# EAGLE design Teensy_ETH (EAGLE 9.6.2)

## Sheet 1 of 2
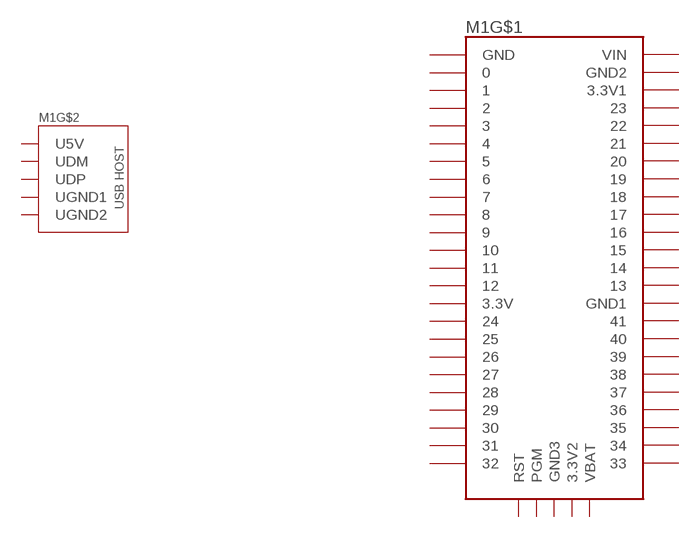
[diagram p0: schematic, sheet 1]

### Parts
M1  TEENSY4.1  [TEENSY4.1]
Unconnected: M1.0/RX M1.1/TX M1.2 M1.3 M1.3V3(3.3V) M1.3V3_LO(3.3V1) M1.4 M1.5 M1.6 M1.7 M1.8 M1.9 M1.10/CS M1.11/MOSI M1.12/MISO M1.13/SCK M1.14/A0 M1.15/A1 M1.16/A2 M1.17/A3 M1.18/A4/SDA M1.19/A5/SCL M1.20/A6 M1.21/A7 M1.22/A8 M1.23/A9 M1.24 M1.25 M1.26 M1.27 M1.28 M1.29 M1.30 M1.31/A12 M1.32 M1.33 M1.34 M1.35 M1.36 M1.37 M1.38 M1.39 M1.40 M1.41 M1.AGND(GND2) M1.GND M1.GND1 M1.GND2(GND3) M1.GND-U1(UGND1) M1.GND-U2(UGND2) M1.PROG(PGM) M1.RST M1.UD+(UDP) M1.UD-(UDM) M1.UVHST(U5V) M1.V33(3.3V2) M1.VBAT M1.VIN

## Sheet 2 of 2
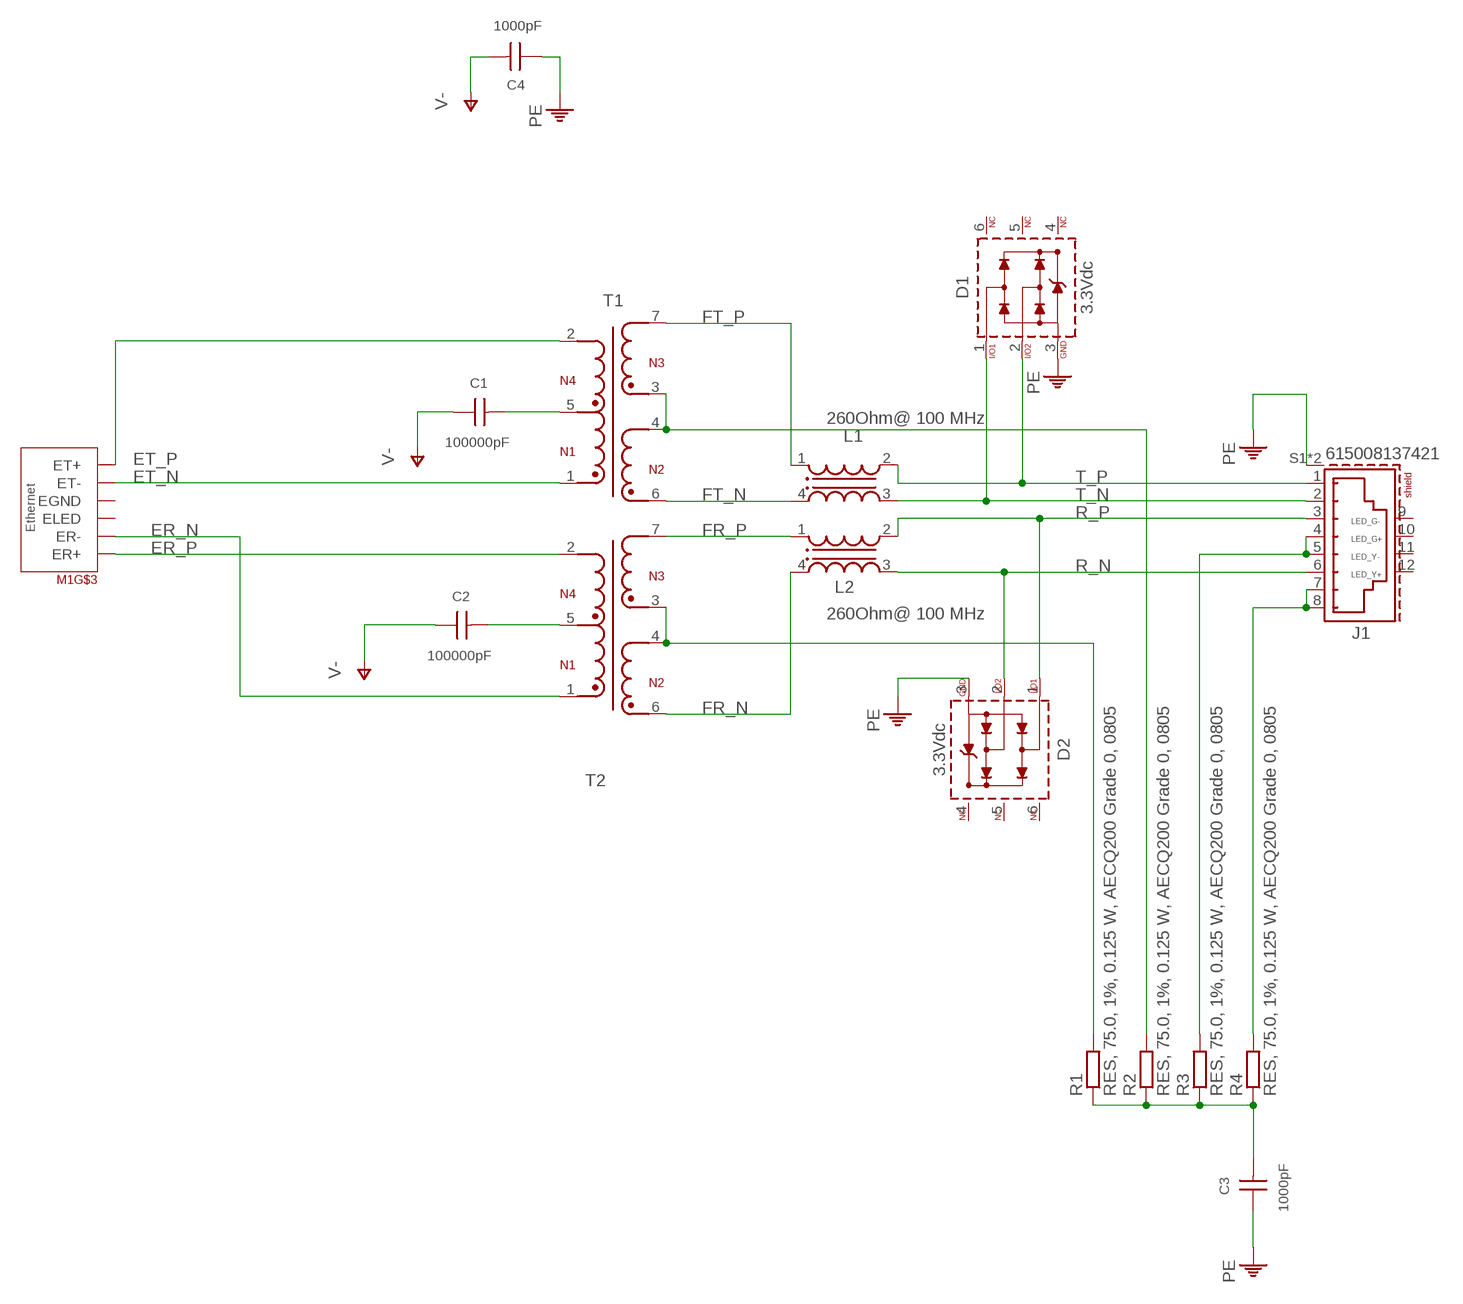
[diagram p1: schematic, sheet 2]

### Parts
C1  100000pF  WCAP-CSST_0603_885382206004_R  [WCAP-CSST_0603_R]
C2  100000pF  WCAP-CSST_0603_885382206004_R  [WCAP-CSST_0603_R]
C3  1000pF  WCAP-CSMH_1206_H1.6_885342208024  [WCAP-CSMH_1206_H1.6_R]
C4  1000pF  WCAP-CSMH_1206_H1.6_885342208024  [WCAP-CSMH_1206_H1.6_R]
D1  3.3Vdc  WE-TVS-SS_DFN1210-6L_824012823  [WE-TVS_DFN1210-6L]
D2  3.3Vdc  WE-TVS-SS_DFN1210-6L_824012823  [WE-TVS_DFN1210-6L]
J1  615008137421  [615008137421]
L1  260Ohm@ 100 MHz  WE-CNSW_0805_744231261  [WE-CNSW_0805]
L2  260Ohm@ 100 MHz  WE-CNSW_0805_744231261  [WE-CNSW_0805]
R1  RES, 75.0, 1%, 0.125 W, AECQ200 Grade 0, 0805  R-EU_R0805  [R0805]
R2  RES, 75.0, 1%, 0.125 W, AECQ200 Grade 0, 0805  R-EU_R0805  [R0805]
R3  RES, 75.0, 1%, 0.125 W, AECQ200 Grade 0, 0805  R-EU_R0805  [R0805]
R4  RES, 75.0, 1%, 0.125 W, AECQ200 Grade 0, 0805  R-EU_R0805  [R0805]
T1  WE-STST_4532_74930000  [WE-STST_74930000]
T2  WE-STST_4532_74930000  [WE-STST_74930000]

### Nets
ER_N: M1.ER- T2.1
ER_P: M1.ER+ T2.2
ET_N: M1.ET+(ET-) T1.1
ET_P: M1.ET-(ET+) T1.2
FR_N: L2.4 T2.6
FR_P: L2.1 T2.7
FT_N: L1.4 T1.6
FT_P: L1.1 T1.7
N$1: R2.2 T1.3 T1.4
N$2: R1.2 T2.3 T2.4
N$7: J1.4 J1.5 R3.2
N$8: J1.7 J1.8 R4.2
N$17: C1.2 T1.5
N$18: C2.2 T2.5
N$19: C3.2 R1.1 R2.1 R3.1 R4.1
PE: C3.1 C4.1 D1.3(GND) D2.3(GND) J1.S1(SHIELD) J1.S2(SHIELD)
R_N: D2.2(I/O2) J1.6 L2.3
R_P: D2.1(I/O1) J1.3 L2.2
T_N: D1.1(I/O1) J1.2 L1.3
T_P: D1.2(I/O2) J1.1 L1.2
V-: C1.1 C2.1 C4.2
Unconnected: D1.4(NC) D1.5(NC1) D1.6(NC2) D2.4(NC) D2.5(NC1) D2.6(NC2) J1.9(G-) J1.10(G+) J1.11(Y-) J1.12(Y+) M1.ELED M1.GND-E(EGND)

## Library data of the parts
C1 C2 = Wurth_Capacitors_WCAP-CSST:WCAP-CSST_0603: WCAP-CSST MLCCs Soft Termination Characteristics Product series with high absorbtion of mechanical stress Mounting style: SMT-Chip Capacitance range: 220 pF - 2.2 µF Temperature Coefficient: ± 15 % Voltage range (UR): 16 V(DC) - 2 kV(DC) Operating temperature: -55 °C up to + 125 °C Sizes: 0603 / 0805 / 1206 / 1210 Termination: Ag-Polymer/Ni/Sn Recommended soldering: Reflow soldering Wave soldering (only valid for the thickness ≤0.85 mm) Applications Application with high mechanical stress Power supply Lighting <https://www.we-online.com/catalog/media/o164343v209%20Family_WE-MLCC_1210_dunkelbraun.jpg> Details see: https://www.we-online.com/catalog/en/WCAP-CSST/ Updated by yingchun,Shan;2020-03-10 2020(C) Würth Elektronik; CERAMIC-TYPE: X7R Class II; DATASHEET-URL: https://www.we-online.com/catalog/datasheet/885382206004.pdf; DF: 3.0%; H: 0.8mm; OPERATING-TEMPERATURE: -55 / +125°C; PART-NUMBER: 885382206004; RISO: 5GOhm; TECHNICAL-REFERENCE: X7R0603104K050DFCT1S000; TOL-C: +/- 10%; VR: 50V(DC)
C3 C4 = Wurth_Capacitors_WCAP-CSMH:WCAP-CSMH_1206_H1.6: WCAP-CSMH MLCCs Mid and High Voltage Characteristics Product series for mid and high voltage up to 3 kV(DC) Mounting style: SMT-Chip Ceramic: NP0 (Class I), X7R (Class II) Capacitance range: 10 pF ‒ 470 nF Temperature Coefficient: ±30 ppm/°C; ±0.54 % for NP0 ±15 % for X7R Voltage range (UR): 200 V(DC) ‒ 3 kV(DC) Operating temperature: -55 °C up to + 125 °C Sizes: 0603 / 0805 / 1206 / 1210 / 1808 / 1812 Termination: Cu/Ni/Sn Recommended soldering: Reflow soldering Wave soldering only valid for 0603, 0805; thickness < 0.85 mm Applications Ports protection against EFT and surge Blocking High voltage coupling Snubber <https://www.we-online.com/catalog/media/o166505v209%20Family_WE-MLCC_1210.jpg> Details see: www.we-online.com/catalog/WCAP-CSMH <www.we-online.com/catalog/WCAP-CSMH/?utm_source=eagle_model&utm_medium=description_link&utm_campaign=eisos_eagle> Updated by Ella Wu 2022-08-02 2022(C) Würth Elektronik; CERAMIC-TYPE: X7R Class II; DATASHEET-URL: https://www.we-online.com/redexpert/spec/885342208024?ae; DF: 2.5%; H: 1.6mm; OPERATING-TEMPERATURE: -55 °C up to + 125 °C; PART-NUMBER: 885342208024; QMIN: -; RISO: 10GOhm; SIZE: 1206; TECHNICAL-REFERENCE: X7R1206102KB00DFCT10000; VR: 2000V(DC)
D1 D2 = Wurth_EMC Components_WE-TVS:WE-TVS-SS_DFN1210-6L_824012823: WE-TVS TVS Diode – Super Speed Series Characteristics Fast turn-on Low clamping voltage Very low capacitance Rail to Rail protection Small package Epoxy flame resistant UL94-V0 Applications Super Speed data lines HDMI 1.3/1.4/2.0, DVI DisplayPort USB 3.1 Gen 1 (5Gb/s) SATA and eSATA GBit LAN Thunderbolt LVDS ESD protection in accordance with EN 61000-4-2 – 8 kV contact discharge – 15 kV air discharge SS = Super Speed <https://www.we-online.com/catalog/media/o106434v209%20Family_WE-TVS-SuperSpeed.jpg> Details see: https://www.we-online.com/catalog/en/WE-TVS-SS Updated by Ella Wu 2019-07-12 2019 (C) Wurth Elektronik; C-CH: 0.18pF; CHANNELS: 2; DATASHEET-URL: https://www.we-online.com/catalog/datasheet/824012823.pdf; IPEAK: 3A; MOUNT: SMT; PART-NUMBER: 824012823; VBR: 4.5V
J1 = Wurth_Connectors_WR-MJ:615008137421: WR-MJ Modular Jack Tab Up General Information Operating Temperature -40 up to +85 °C LED 2xBipolar Y/G; yellow-green Electrical Properties Working Voltage 120 V (AC) Withstanding Voltage 1000 V (AC) Contact Resistance 20 mΩ RISO 500 MΩ Material Properties Insulator Material PBT Insulator Flammability Rating UL94 V-0 Insulator Color Black Contact Material Copper Alloy Contact Plating Selective Gold Contact Type Stamped Shielding Material Bronze Shielding Plating Nickel (Ni) Packaging Properties Packaging Tray <https://www.we-online.com/components/media/o33152v209%20Family_WR-MJ_6150081xxx21.jpg> Details see: www.we-online.com/en/components/products/MJ_HORIZONTAL_SHIELDED_W_LED_AND_EMI_PANEL_FINGER_8P8C_TAB_UP <www.we-online.com/catalog/MJ_HORIZONTAL_SHIELDED_W_LED_AND_EMI_PANEL_FINGER_8P8C_TAB_UP/?utm_source=eagle_model&utm_medium=description_link&utm_campaign=eisos_eagle> Updated by Ella Wu 2023-11-13 2023 (C) Würth Elektronik; DATASHEET-URL: https://www.we-online.com/redexpert/spec/615008137421?ae; LED: yellow-green; MOUNT: THT; PART-NUMBER: 615008137421; TYPE: Horizontal; XPXC: 8P8C
L1 L2 = Wurth_EMC Components_WE-CNSW:WE-CNSW_0805: WE-CNSW SMD Common Mode Line Filter Characteristics Current compensated data line filter High common mode noise suppression at high frequencies Small influence on high speed signals through winding symmetry Climatic category 40/105/21 (Size 0603) Climatic category 40/125/21 (Size 0805/1206/1812) Flammability corresponding to UL 94 V-0 Applications USB 2.0 IEEE 1394 (Firewire) LVDS High Speed Data Lines LAN <https://katalog.we-online.com/media/images/v2/o14771v209%20we-cnsw_stroko_smd_gruppe.jpg> Details see: http://katalog.we-online.de/en/pbs/WE-CNSW Updated by Ella Wu 2019-01-09 2019 (C) Wurth Elektronik; DATASHEET-URL: https://katalog.we-online.com/pbs/datasheet/744231261.pdf; IR: 300mA; MOUNT: SMT; PART-NUMBER: 744231261; RDC: 0.4Ohm; VR: 50V; VT: 125 V (AC)
M1 = teensy4.1.dist:TEENSY4.1
R1-R4 = resistor:R-EU_: RESISTOR, European symbol
T1 T2 = Wurth_Signal & Communications_WE-STST:WE-STST_4532: WE-STST Super Tiny Signal Transformer Characteristics Super small size 1.5 kV isolation voltage 350 µH OCL as per IEEE 802.3 Operating temperature: -40 °C up to +105 °C Applications Ethernet 10/100/1000 Base-T Ethernet 2.5/5G and 10G Base-T Single Pair Ethernet Ultrasonic sensors g.fast <https://www.we-online.com/components/media/o156816v209%20Family_WE-STST.jpg> Details see: www.we-online.com/en/components/products/WE-STST <www.we-online.com/catalog/WE-STST/?utm_source=eagle_model&utm_medium=description_link&utm_campaign=eisos_eagle> Updated by Ella Wu 2023-12-25 2023(C) Wurth Elektronik; DATA-RATE: 10/100/1000 Base-T, 10/100 Base-T1; DATASHEET-URL: https://www.we-online.com/catalog/datasheet/74930000.pdf; L: 350uH; MOUNT: SMT; PART-NUMBER: 74930000; TURNS-RATIO: 1:1; VT: 1500 V (RMS)

## Board
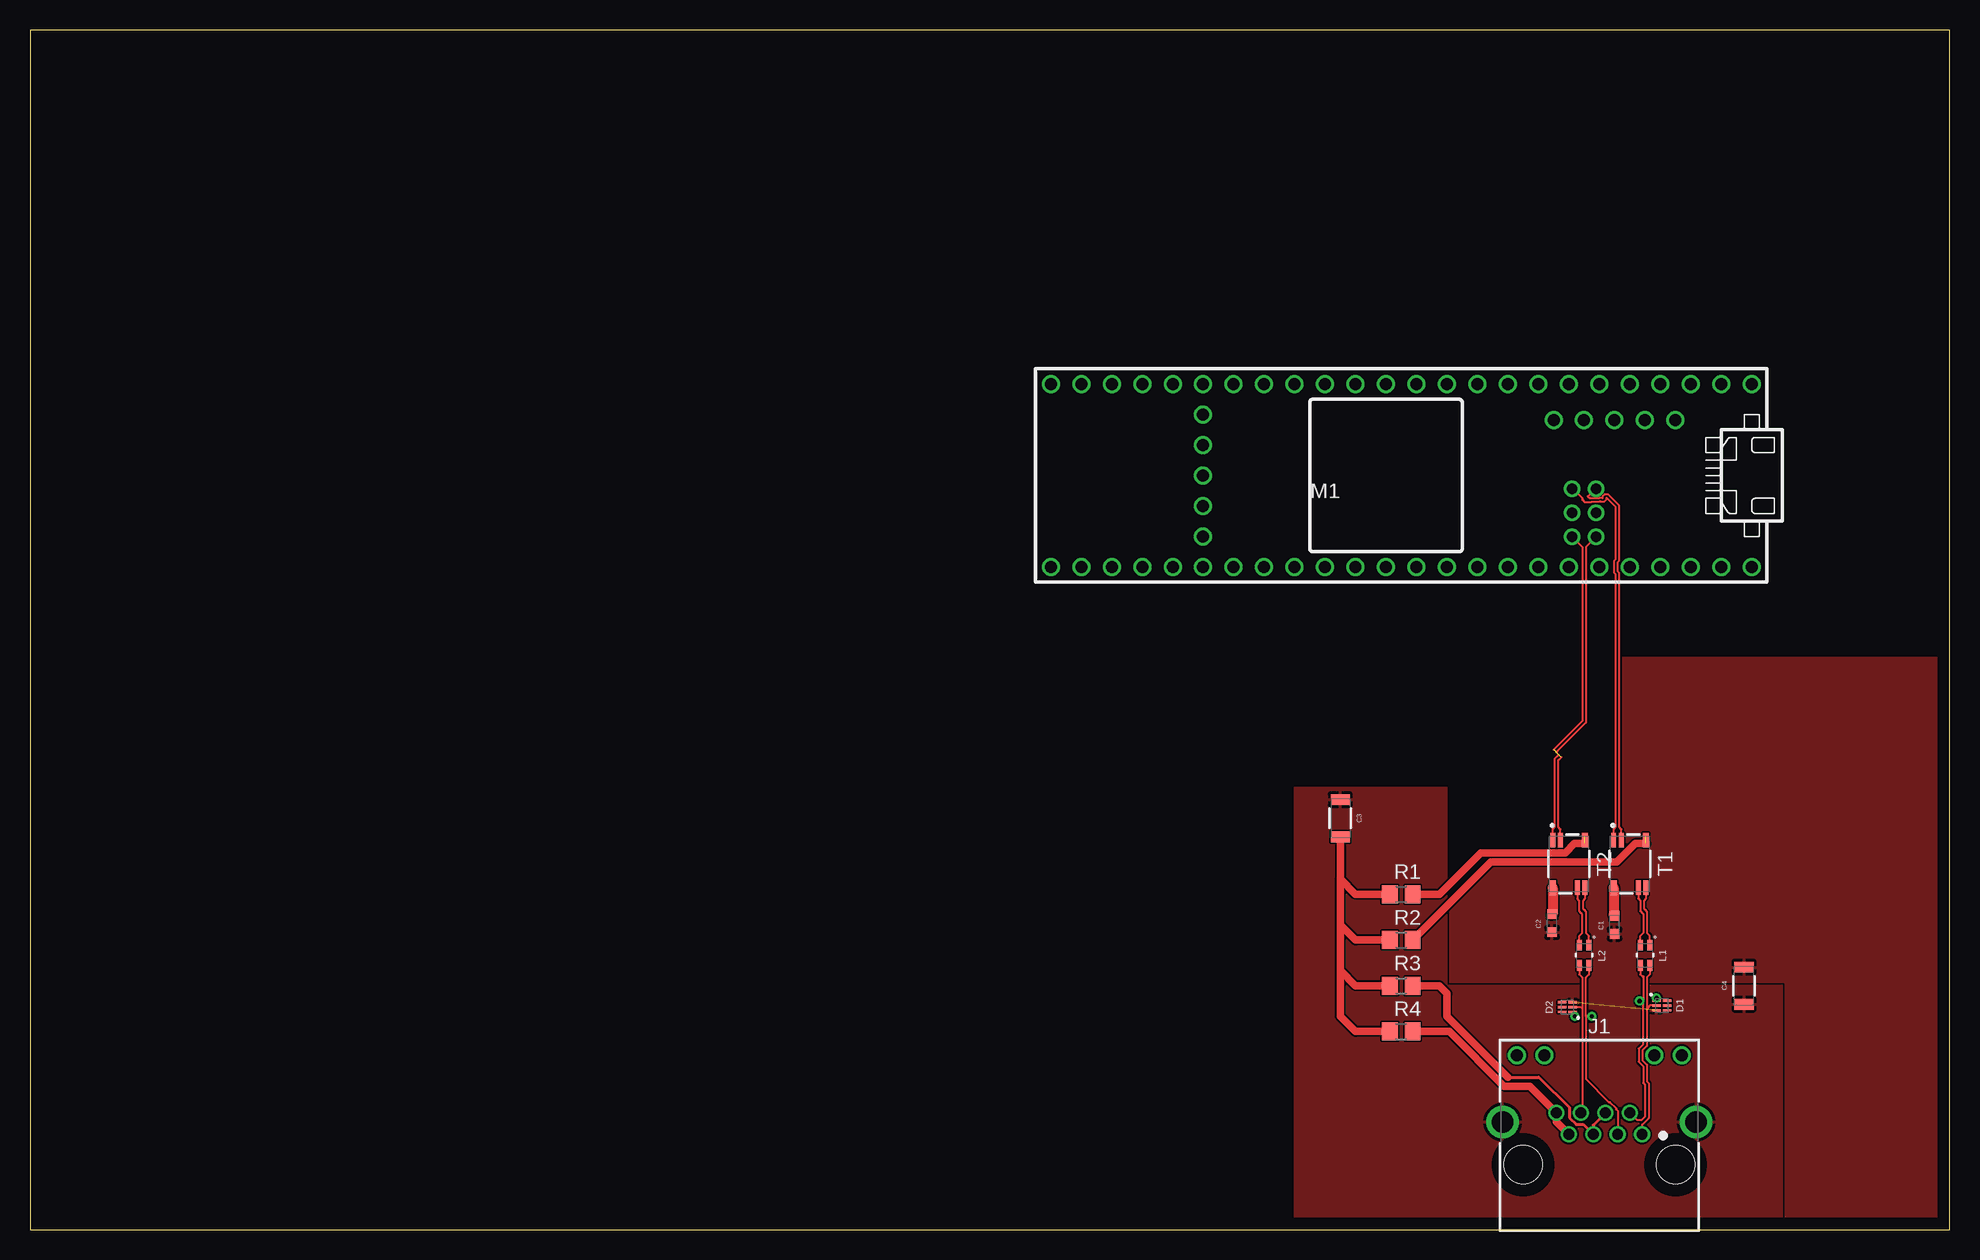
[diagram p2: board, top side]
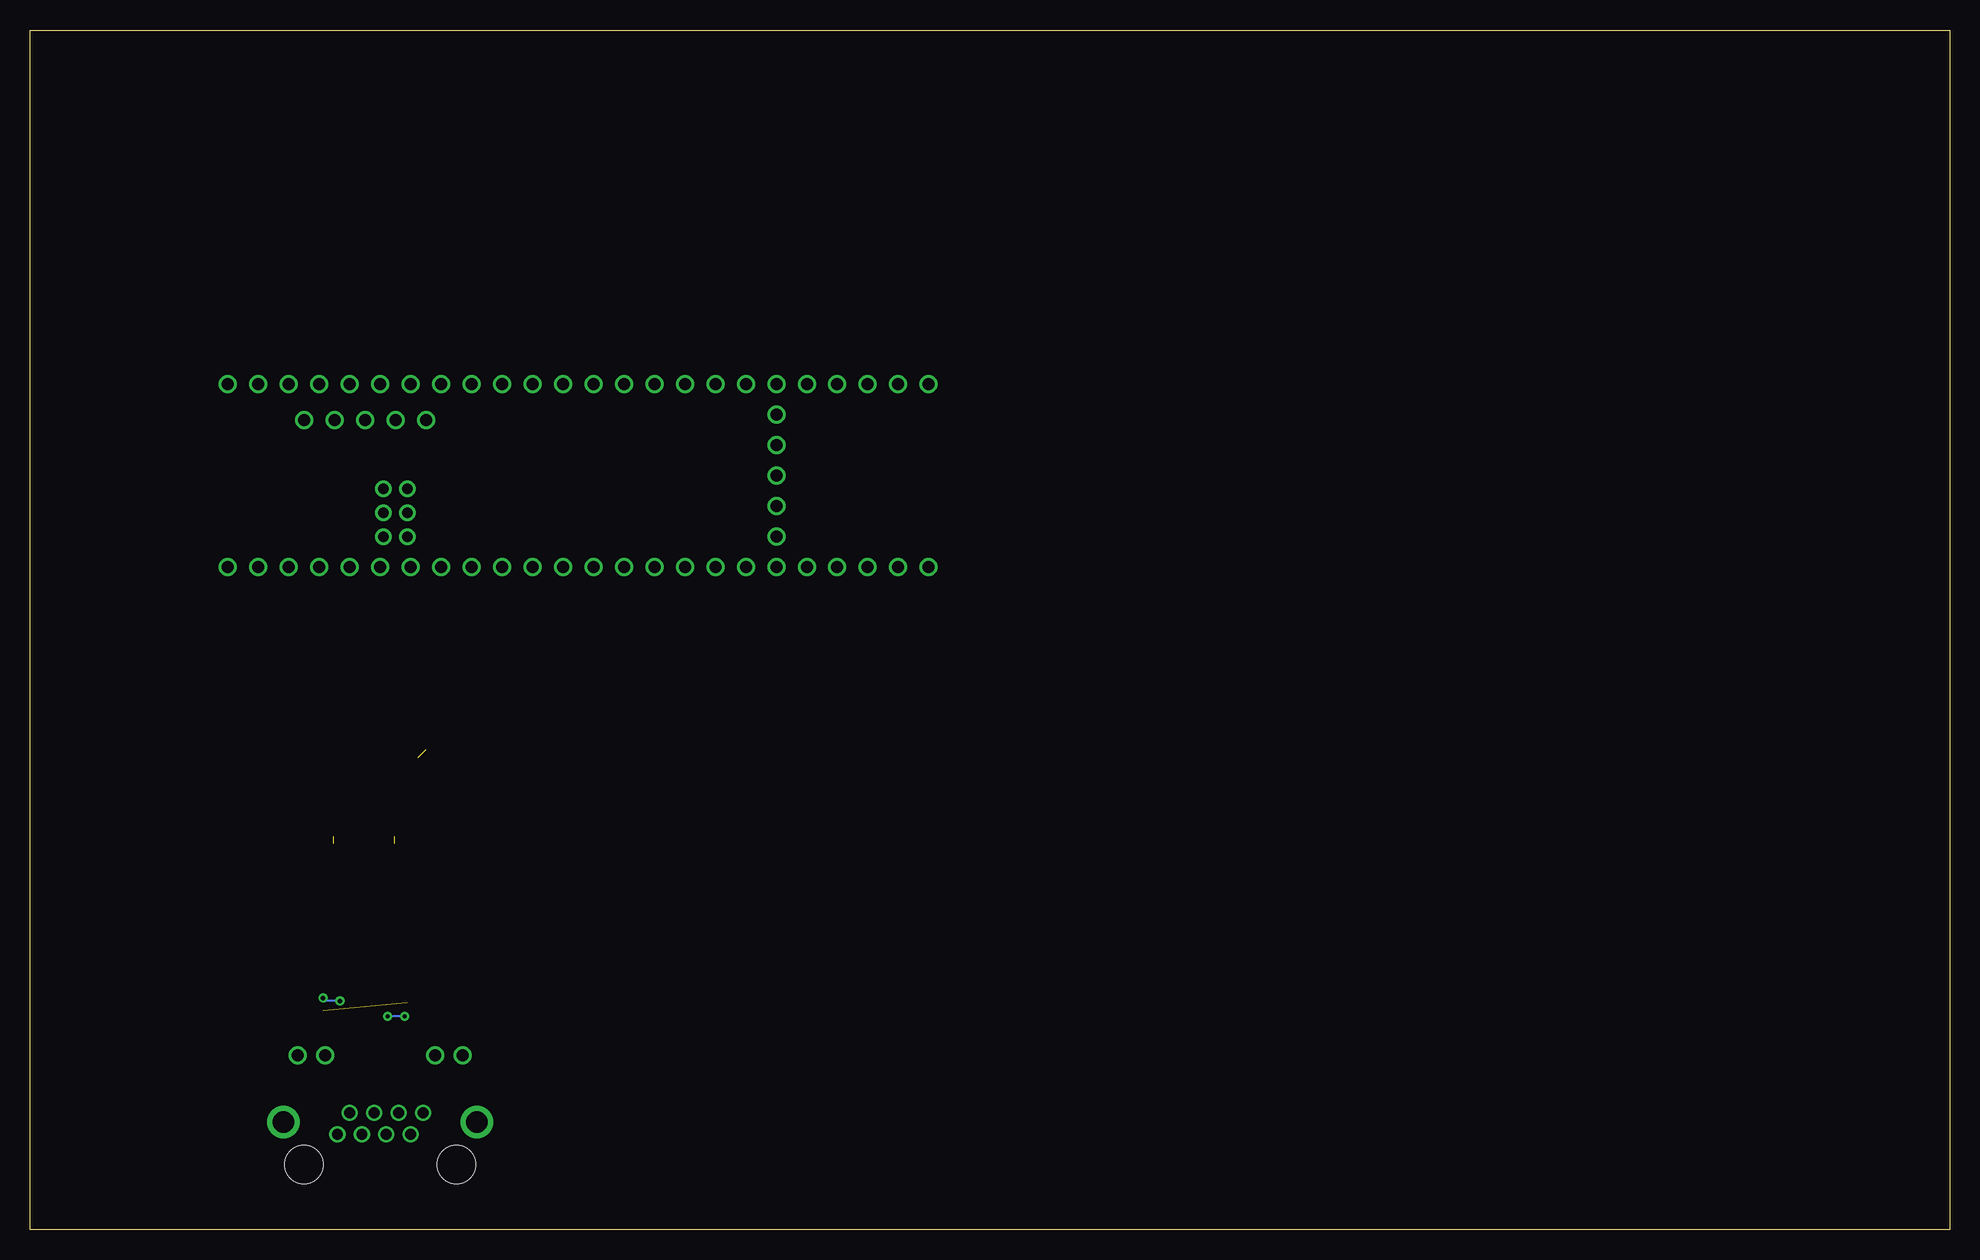
[diagram p3: board, bottom side, seen from below]

Size 160 x 100 mm. Coordinates in mm from the lower left corner, seen from the top.
Outline: 0,0 160,0 160,100 0,100 0,0
Copper layers (1*16): Top 0.035mm / dielectric 1.5mm / Bottom 0.035mm
Design rules "default *": minimum track width 6mil, minimum drill 0.35mm, track to track 6mil, track to pad 6mil, pad to pad 6mil, via to via 6mil, smd to smd 1mil, copper to edge 40mil, drill to drill 6mil, minimum pad ring 6mil, minimum via ring 8mil, stop-mask expansion 4mil, vias tented up to drill 0mil, thermal gap 10mil

### Footprints (pad centres in the part's own frame; a part is rotated, then mirrored left to right if it is on the bottom)
WCAP-CSST_0603_R = smd 0.8 x 0.8: 1 -0.75,0; 2 0.75,0
WCAP-CSMH_1206_H1.6_R = smd 0.9 x 1.6: 1 -1.55,0; 2 1.55,0
WE-TVS_DFN1210-6L = smd 0.2 x 0.675: 1 -0.4,-0.438; 2 0,-0.438; 3 0.4,-0.438; 4 0.4,0.438; 5 0,0.438; 6 -0.4,0.438
615008137421 = drill 0.9: 1 3.57,2.54; 2 2.55,4.32; 3 1.53,2.54; 4 0.51,4.32; 5 -0.51,2.54; 6 -1.53,4.32; 7 -2.55,2.54; 8 -3.57,4.32 | drill 1: 9 6.86,9.13; 10 4.57,9.13; 11 -4.57,9.13; 12 -6.86,9.13 | drill 1.8: S1 -8.075,3.56; S2 8.075,3.56 | hole 3.2: -6.35,0; 6.35,0
WE-CNSW_0805 = smd 0.9 x 0.4: 1 -0.85,0.4; 2 0.85,0.4; 3 0.85,-0.4; 4 -0.85,-0.4
TEENSY4.1 = drill 1: 0/RX -26.67,-7.62; 1/TX -24.13,-7.62; 2 -21.59,-7.62; 3 -19.05,-7.62; 3V3 6.35,-7.62; 3V3_LO -24.13,7.62; 4 -16.51,-7.62; 5 -13.97,-7.62; 6 -11.43,-7.62; 7 -8.89,-7.62; 8 -6.35,-7.62; 9 -3.81,-7.62; 10/CS -1.27,-7.62; 11/MOSI 1.27,-7.62; 12/MISO 3.81,-7.62; 13/SCK 3.81,7.62; 14/A0 1.27,7.62; 15/A1 -1.27,7.62; 16/A2 -3.81,7.62; 17/A3 -6.35,7.62; 18/A4/SDA -8.89,7.62; 19/A5/SCL -11.43,7.62; 20/A6 -13.97,7.62; 21/A7 -16.51,7.62; 22/A8 -19.05,7.62; 23/A9 -21.59,7.62; 24 8.89,-7.62; 25 11.43,-7.62; 26 13.97,-7.62; 27 16.51,-7.62; 28 19.05,-7.62; 29 21.59,-7.62; 30 24.13,-7.62; 31/A12 26.67,-7.62; 32 29.21,-7.62; 33 29.21,7.62; 34 26.67,7.62; 35 24.13,7.62; 36 21.59,7.62; 37 19.05,7.62; 38 16.51,7.62; 39 13.97,7.62; 40 11.43,7.62; 41 8.89,7.62; AGND -26.67,7.62; GND -29.21,-7.62; GND1 6.35,7.62; GND2 16.51,0; GND-U1 -15.24,-4.62; GND-U2 -12.7,-4.62; PROG 16.51,2.54; RST 16.51,5.08; UD+ -17.78,-4.62; UD- -20.32,-4.62; UVHST -22.86,-4.62; V33 16.51,-2.54; VBAT 16.51,-5.08; VIN -29.21,7.62 | drill 0.9: ELED -16.24,3.12; ER+ -16.24,5.12; ER- -14.24,5.12; ET+ -14.24,1.12; ET- -16.24,1.12; GND-E -14.24,3.12
R0805 = smd 1.3 x 1.5: 1 -0.95,0; 2 0.95,0
WE-STST_74930000 = smd 1.2 x 0.41: 1 -1.99,-1.35; 2 -1.99,-0.7; 6 1.99,0.7; 7 1.99,1.35 | smd 0.6 x 0.5: 3 -2.29,1.35; 4 -1.69,1.35 | smd 1.2 x 0.5: 5 1.99,-1.35

### Placement (x,y rotation side)
C1  132.08,25.4 90 top
C2  126.87,25.53 90 top
C3  109.22,34.29 270 top
C4  142.88,20.32 90 top
D1  136.02,18.67 270 top
D2  128.14,18.54 90 top
J1  130.81,5.4 0 top
L1  134.62,22.86 270 top
L2  129.54,22.86 270 top
M1  114.3,62.87 180 top
R1  114.3,27.94 0 top
R2  114.3,24.13 0 top
R3  114.3,20.32 0 top
R4  114.3,16.51 0 top
T1  133.35,30.48 270 top
T2  128.27,30.48 270 top

### Tracks (layer width: path | path; a pad name or v marks a point on that pad's centre or on a via)
ER_N  (1 unrouted)
  Top 0.152: T2.1 126.92,33.38 127.09,33.55 127.09,39.26 127.32,39.48 127.34,39.48 127.43,39.57 | M1.ER- 129.39,56.9 129.39,42.39 127,40.01
ER_P  (1 unrouted)
  Top 0.152: T2.2 127.57,33.38 127.4,33.55 127.4,39.13 127.44,39.18 127.47,39.18 127.65,39.36 | M1.ER+ 129.69,56.9 129.69,42.27 127.32,39.89 | 127.32,39.89 | 127.32,39.89 127.22,39.79
ET_N
  Top 0.152: T1.1 132,33.38 132.17,33.55 132.17,54.6 132.06,54.71 132.06,55.78 132.17,55.89 132.17,60.23 131.44,60.96 131.38,60.96 131.38,60.83 131.2,60.66 130.95,60.66 130.93,60.68 130.81,60.68 130.15,60.68 130.13,60.66 129.57,60.66 129.39,60.83 129.39,60.96 128.6,61.74 M1.ET+
ET_P
  Top 0.152: T1.2 132.65,33.38 132.48,33.55 132.48,54.73 132.37,54.84 132.37,55.65 132.48,55.76 132.48,60.36 131.85,60.98 | M1.ET- 130.48,61.74 129.85,61.12 130,60.96 130.03,60.98 130.81,60.98 131.05,60.98 | 131.05,60.98 131.07,60.96 | 131.85,60.98 | 131.85,60.98 131.57,61.27 131.25,61.27 131.07,61.09 131.07,60.98 131.05,60.98
FR_N
  Top 0.152: T2.6 128.97,27.59 129.14,27.41 129.14,26.54 129.32,26.36 129.39,26.3 129.39,24.71 129.14,24.46 L2.4
FR_P
  Top 0.152: T2.7 129.62,27.59 129.45,27.41 129.45,26.74 129.51,26.67 129.69,26.49 129.69,24.71 129.94,24.46 L2.1
FT_N
  Top 0.152: L1.4 134.22,24.46 134.47,24.71 134.47,26.3 134.4,26.36 134.22,26.54 134.22,27.41 134.05,27.59 T1.6
FT_P
  Top 0.152: L1.1 135.02,24.46 134.77,24.71 134.77,26.49 134.59,26.67 134.53,26.74 134.53,27.41 134.7,27.59 T1.7
N$1  (1 unrouted)
  Top 0.61: T1.4 133.8,32.17 132.28,30.65 121.77,30.65 R2.2
N$2  (1 unrouted)
  Top 0.61: T2.4 128.72,32.17 127.96,31.41 120.95,31.41 117.47,27.94 R1.2
N$7
  Top 0.254: J1.4 130.3,8.7 J1.5 129.47,8.77 128.88,8.77 128.33,9.32 128.33,10.12 128.34,10.13 125.77,12.7 123.19,12.7
  Top 0.61: 123.19,12.7 118.11,17.78 118.11,19.68 117.47,20.32 R3.2
N$8
  Top 0.61: J1.7 127.24,8.96 J1.8 125.02,11.94 122.87,11.94 118.3,16.51 R4.2
N$17
  Top 0.813: T1.5 132,26.23 C1.2
N$18
  Top 0.813: T2.5 126.92,26.32 C2.2
N$19
  Top 0.61: R1.1 110.49,27.94 109.22,29.21 | C3.2 109.22,29.21 | R4.1 110.49,16.51 109.22,17.78 109.22,21.59 | 109.22,21.59 109.22,25.4 | 109.22,25.4 109.22,29.21 | 109.22,25.4 110.49,24.13 R2.1 | R3.1 110.49,20.32 109.22,21.59
PE  (1 unrouted)
  pour Top: 146.05,0 146.05,20.32 118.11,20.32 118.11,36.83 105.41,36.83 105.41,0
R_N
  Top 0.152: L2.3 129.14,21.25 129.39,21.01 129.39,18.41 | D2.2 129.26,18.54 129.39,18.41 | J1.6 129.39,9.83 129.39,18.41
R_P  (via drill 0.35)
  Top 0.152: L2.2 129.94,21.25 129.69,21.01 129.69,17.78 | D2.1 128.91,17.82 128.91,17.78 v128.78,17.78 | v130.18,17.78 129.69,17.78 | 129.69,17.78 129.69,12.55 131.62,10.62 131.69,10.62 132.22,10.09 132.22,10.02 132.34,9.9 J1.3
  Bottom 0.152: v128.78,17.78 v130.18,17.78
T_N  (via drill 0.35)
  Top 0.152: J1.2 133.93,9.15 134.36,9.15 134.62,9.42 134.62,12.06 134.47,12.22 134.47,13.62 134.09,14 134.09,15.06 134.47,15.44 134.47,19.05 | L1.3 134.22,21.25 134.47,21.01 | 134.47,21.01 134.47,19.05 | 134.47,21.13 134.47,21.01 | 134.47,19.05 v134.17,19.05 | v135.58,19.3 D1.1
  Bottom 0.152: v135.58,19.3 135.33,19.05 v134.17,19.05
T_P
  Top 0.152: J1.1 134.38,8.74 134.93,9.29 134.93,12.19 134.77,12.34 134.77,13.75 134.4,14.12 134.4,14.94 134.77,15.31 134.77,18.41 | L1.2 135.02,21.25 134.77,21.01 134.77,18.41 | D1.2 135.03,18.67 134.77,18.41
V-
  pour Top (rank 2): 160.02,0 160.02,47.62 90.17,47.62 90.17,0
(copper drawn outside any net)
  shapes: Top area x1